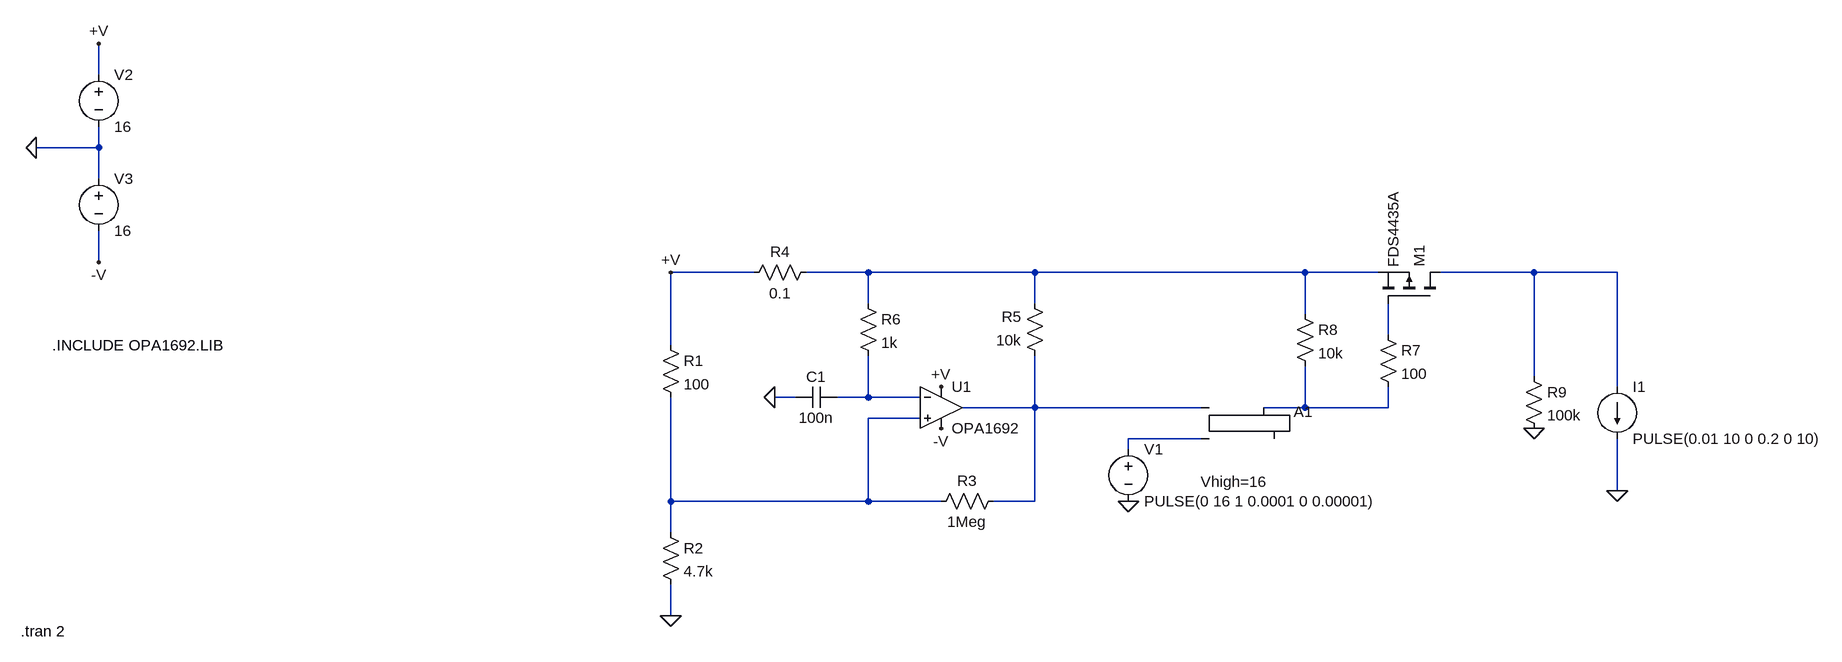
[diagram p0: schematic Current limit v1.asc]
Current limit v1.asc, the LTspice schematic file:
Version 4
SHEET 1 1852 900
WIRE -816 -288 -816 -336
WIRE -816 -176 -816 -208
WIRE -816 -176 -912 -176
WIRE -816 -128 -816 -176
WIRE -816 0 -816 -48
WIRE 192 16 64 16
WIRE 368 16 272 16
WIRE 624 16 368 16
WIRE 1040 16 624 16
WIRE 1152 16 1040 16
WIRE 1392 16 1248 16
WIRE 1520 16 1392 16
WIRE 368 64 368 16
WIRE 624 64 624 16
WIRE 1040 80 1040 16
WIRE 1168 112 1168 64
WIRE 64 128 64 16
WIRE 1392 176 1392 16
WIRE 1520 192 1520 16
WIRE 256 208 224 208
WIRE 368 208 368 144
WIRE 368 208 320 208
WIRE 448 208 368 208
WIRE 624 224 624 144
WIRE 624 224 512 224
WIRE 880 224 624 224
WIRE 1040 224 1040 160
WIRE 1040 224 976 224
WIRE 1168 224 1168 192
WIRE 1168 224 1040 224
WIRE 448 240 368 240
WIRE 880 272 768 272
WIRE 768 288 768 272
WIRE 1520 352 1520 272
WIRE 64 368 64 208
WIRE 368 368 368 240
WIRE 368 368 64 368
WIRE 480 368 368 368
WIRE 624 368 624 224
WIRE 624 368 560 368
WIRE 64 416 64 368
WIRE 64 544 64 496
FLAG 64 16 +V
FLAG 64 544 0
FLAG 768 368 0
FLAG 224 208 0
FLAG -912 -176 0
FLAG -816 -336 +V
FLAG -816 0 -V
FLAG 480 192 +V
FLAG 480 256 -V
FLAG 1520 352 0
FLAG 1392 256 0
SYMBOL res 48 112 R0
SYMATTR InstName R1
SYMATTR Value 100
SYMBOL pmos 1248 64 M270
SYMATTR InstName M1
SYMATTR Value FDS4435A
SYMBOL res 48 400 R0
SYMATTR InstName R2
SYMATTR Value 4.7k
SYMBOL res 576 352 R90
WINDOW 0 0 56 VBottom 2
WINDOW 3 32 56 VTop 2
SYMATTR InstName R3
SYMATTR Value 1Meg
SYMBOL res 288 0 R90
WINDOW 0 0 56 VBottom 2
WINDOW 3 32 56 VTop 2
SYMATTR InstName R4
SYMATTR Value 0.1
SYMBOL res 640 160 R180
WINDOW 0 36 76 Left 2
WINDOW 3 36 40 Left 2
SYMATTR InstName R5
SYMATTR Value 10k
SYMBOL Digital\\srflop 928 176 R0
WINDOW 39 -49 162 Left 2
SYMATTR SpiceLine Vhigh=16
SYMATTR InstName A1
SYMBOL voltage 768 272 R0
WINDOW 123 0 0 Left 0
WINDOW 39 0 0 Left 0
SYMATTR InstName V1
SYMATTR Value PULSE(0 16 1 0.0001 0 0.00001)
SYMBOL OpAmps\\opamp2 480 160 R0
SYMATTR InstName U1
SYMATTR Value OPA1692
SYMBOL res 352 48 R0
SYMATTR InstName R6
SYMATTR Value 1k
SYMBOL cap 320 192 R90
WINDOW 0 0 32 VBottom 2
WINDOW 3 32 32 VTop 2
SYMATTR InstName C1
SYMATTR Value 100n
SYMBOL voltage -816 -304 R0
WINDOW 123 0 0 Left 0
WINDOW 39 0 0 Left 0
SYMATTR InstName V2
SYMATTR Value 16
SYMBOL voltage -816 -144 R0
WINDOW 123 0 0 Left 0
WINDOW 39 0 0 Left 0
SYMATTR InstName V3
SYMATTR Value 16
SYMBOL res 1152 96 R0
SYMATTR InstName R7
SYMATTR Value 100
SYMBOL current 1520 192 R0
WINDOW 123 0 0 Left 0
WINDOW 39 24 108 Left 2
SYMATTR InstName I1
SYMATTR Value PULSE(0.01 10 0 0.2 0 10)
SYMBOL res 1024 64 R0
SYMATTR InstName R8
SYMATTR Value 10k
SYMBOL res 1376 160 R0
SYMATTR InstName R9
SYMATTR Value 100k
TEXT -888 128 Left 2 !.INCLUDE OPA1692.LIB
TEXT -936 568 Left 2 !.tran 2

The netlist it stands for:
* Current limit v1.asc
R1 +V N007 100
M1 N002 N003 N001 N001 FDS4435A
R2 N007 0 4.7k
R3 N005 N007 1Meg
R4 N001 +V 0.1
R5 N005 N001 10k
A1 N005 N008 0 0 0 0 N006 0 SRFLOP Vhigh=16
V1 N008 0 PULSE(0 16 1 0.0001 0 0.00001)
XU1 N007 N004 +V -V N005 OPA1692  ; pins In+ In- V+ V- OUT
R6 N001 N004 1k
C1 N004 0 100n
V2 +V 0 16
V3 0 -V 16
R7 N003 N006 100
I1 N002 0 PULSE(0.01 10 0 0.2 0 10)
R8 N001 N006 10k
R9 N002 0 100k
.model NMOS NMOS
.model PMOS PMOS
.lib standard.mos
.INCLUDE OPA1692.LIB
.tran 2
.backanno
.end